# EAGLE design miditendo_rev1 (EAGLE 6.0)
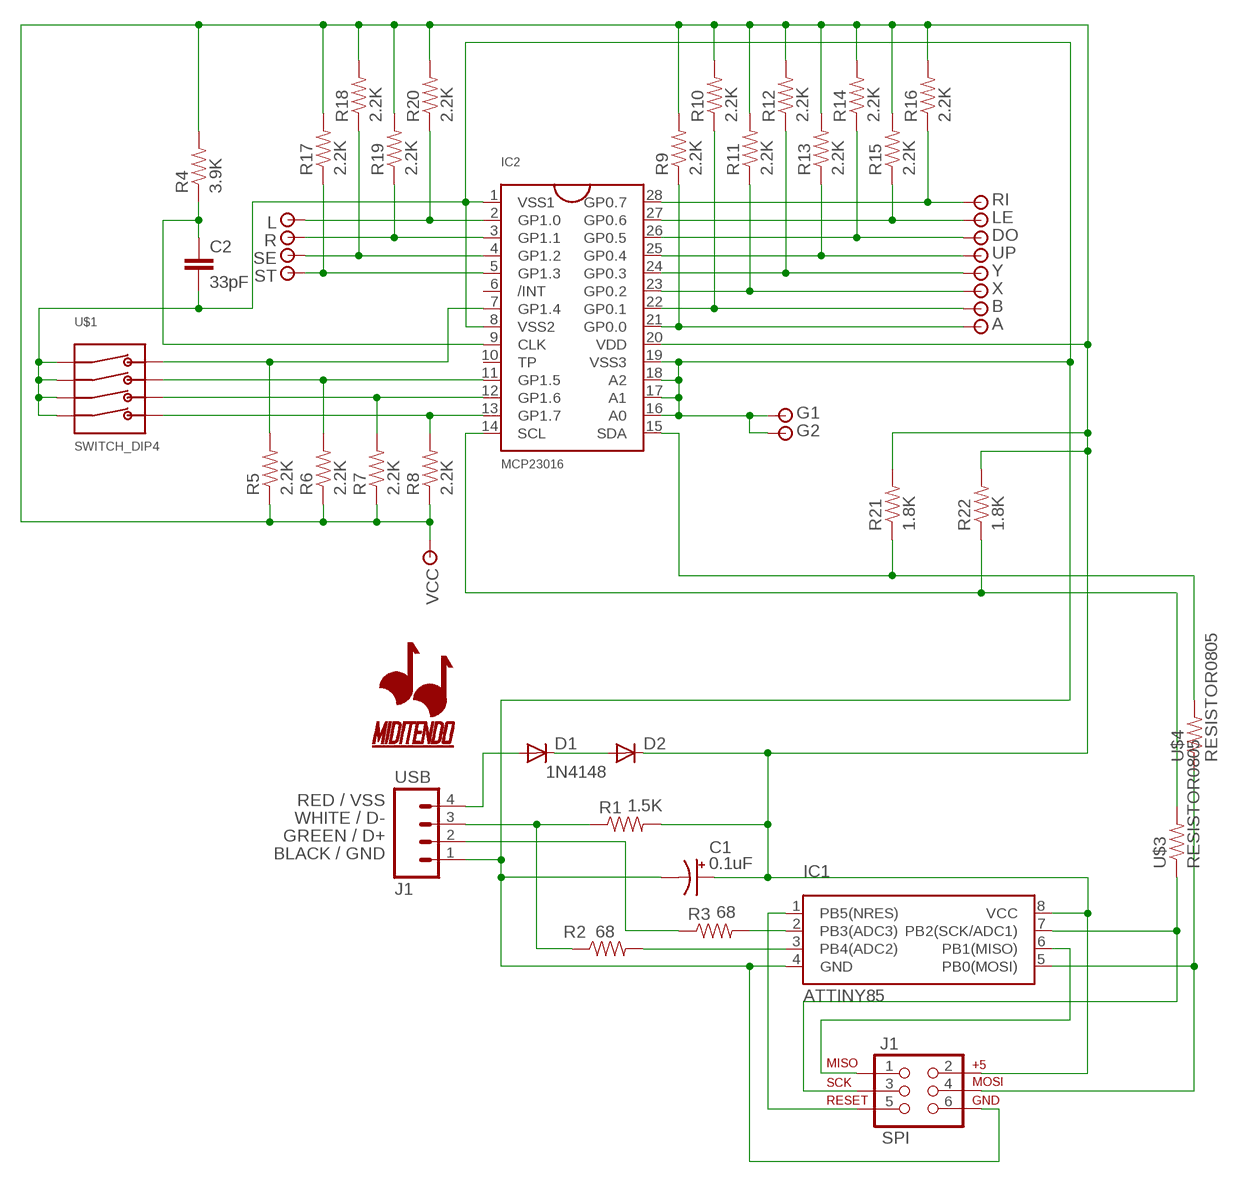
[diagram p0: schematic, sheet 1]

## Parts
A  WIRE_JOINT  [THSOLDERPOINT]
B  WIRE_JOINT  [THSOLDERPOINT]
C1  0.1uF  POLARIZEDCAPACITORTH_2.54  [POLCAP_2.54]
C2  33pF  CAPACITOR0805  [0805]
D1  LL4148SOD-80C  [SOD-80C]
D2  1N4148  LL4148SOD-80C  [SOD-80C]
DO  WIRE_JOINT  [THSOLDERPOINT]
G1  WIRE_JOINT  [THSOLDERPOINT]
G2  WIRE_JOINT  [THSOLDERPOINT]
IC1  ATTINY85  ATTINY85SOIC  [SOIC8-EIAJ]
IC2  MCP23016  MCP23016SOIC28  [SOIC28]
J1  SPI  AVR_SPI_PRG_6NS  [2X3-NS]
L  WIRE_JOINT  [THSOLDERPOINT]
LE  WIRE_JOINT  [THSOLDERPOINT]
R  WIRE_JOINT  [THSOLDERPOINT]
R1  1.5K  RESISTOR0805  [0805]
R2  68  RESISTOR0805  [0805]
R3  68  RESISTOR0805  [0805]
R4  3.9K  RESISTOR0805  [0805]
R5  2.2K  RESISTOR0805  [0805]
R6  2.2K  RESISTOR0805  [0805]
R7  2.2K  RESISTOR0805  [0805]
R8  2.2K  RESISTOR0805  [0805]
R9  2.2K  RESISTOR0805  [0805]
R10  2.2K  RESISTOR0805  [0805]
R11  2.2K  RESISTOR0805  [0805]
R12  2.2K  RESISTOR0805  [0805]
R13  2.2K  RESISTOR0805  [0805]
R14  2.2K  RESISTOR0805  [0805]
R15  2.2K  RESISTOR0805  [0805]
R16  2.2K  RESISTOR0805  [0805]
R17  2.2K  RESISTOR0805  [0805]
R18  2.2K  RESISTOR0805  [0805]
R19  2.2K  RESISTOR0805  [0805]
R20  2.2K  RESISTOR0805  [0805]
R21  1.8K  RESISTOR0805  [0805]
R22  1.8K  RESISTOR0805  [0805]
RI  WIRE_JOINT  [THSOLDERPOINT]
SE  WIRE_JOINT  [THSOLDERPOINT]
ST  WIRE_JOINT  [THSOLDERPOINT]
U$1  SWITCH_DIP4  [SWITCH_4DIP]
U$2  MIDITENDO  [MIDITENDO]
U$3  RESISTOR0805  [0805]
U$4  RESISTOR0805  [0805]
UP  WIRE_JOINT  [THSOLDERPOINT]
USB  J1  M04LONGPADS  [1X04_LONGPADS]
VCC  WIRE_JOINT  [THSOLDERPOINT]
X  WIRE_JOINT  [THSOLDERPOINT]
Y  WIRE_JOINT  [THSOLDERPOINT]

## Nets
GND: C1.N(-) C2.2 G1.P$1 G2.P$1 IC1.4(GND) IC2.1(VSS1) IC2.8(VSS2) IC2.16(A0) IC2.17(A1) IC2.18(A2) IC2.19(VSS3) J1.6 U$1.P$1 U$1.P$2 U$1.P$3 U$1.P$4 USB.1
N$1: D1.PA(A) USB.4
N$2: D1.PC(C) D2.PA(A)
N$3: IC2.2(GP1.0) L.P$1 R20.1
N$4: IC2.15(SDA) R21.1 U$4.2
N$5: R3.1 USB.2
N$6: IC2.14(SCL) R22.1 U$3.2
N$7: IC1.2(PB3(ADC3)) R3.2
N$8: IC1.3(PB4(ADC2)) R2.2
N$9: IC2.3(GP1.1) R19.1 R.P$1
N$10: R1.1 R2.1 USB.3
N$11: IC2.4(GP1.2) R18.1 SE.P$1
N$12: IC2.5(GP1.3) R17.1 ST.P$1
N$13: IC2.28(GP0.7) R16.1 RI.P$1
N$14: IC2.27(GP0.6) LE.P$1 R15.1
N$15: DO.P$1 IC2.26(GP0.5) R14.1
N$16: IC2.25(GP0.4) R13.1 UP.P$1
N$17: IC2.24(GP0.3) R12.1 Y.P$1
N$18: IC2.23(GP0.2) R11.1 X.P$1
N$19: B.P$1 IC2.22(GP0.1) R10.1
N$20: A.P$1 IC2.21(GP0.0) R9.1
N$21: C2.1 IC2.9(CLK) R4.1
N$22: IC1.6(PB1(MISO)) J1.1
N$23: IC1.1(PB5(NRES)) J1.5
N$24: IC1.7(PB2(SCK/ADC1)) J1.3 U$3.1
N$25: IC1.5(PB0(MOSI)) J1.4 U$4.1
N$26: IC2.13(GP1.7) R8.2 U$1.P$5
N$27: IC2.12(GP1.6) R7.2 U$1.P$6
N$28: IC2.11(GP1.5) R6.2 U$1.P$7
N$29: IC2.7(GP1.4) R5.2 U$1.P$8
VDD: C1.P(+) D2.PC(C) IC1.8(VCC) IC2.20(VDD) J1.2 R1.2 R4.2 R5.1 R6.1 R7.1 R8.1 R9.2 R10.2 R11.2 R12.2 R13.2 R14.2 R15.2 R16.2 R17.2 R18.2 R19.2 R20.2 R21.2 R22.2 VCC.P$1
Unconnected: IC2.6(/INT) IC2.10(TP)

## Notes on the sheet
- RED / VSS
- WHITE / D-
- GREEN / D+
- BLACK / GND

## Library data of the parts
A B DO G1 G2 L LE R RI SE ST UP VCC X Y = miditendo:WIRE_JOINT
C1 = miditendo:POLARIZEDCAPACITOR: POLARIZED CAPACITORPolarized Capacitor
C2 = miditendo:CAPACITOR
D1 D2 = miditendo:LL4148: 4148 DIODE The xx4148 diode is a fast, standard small signal silicon diode with high conductance used in signal processing. The 1N4148 variant is generally available in a DO-35 glass package and is very useful at high frequencies with a reverse recovery time of no more than 4ns. This permits rectification and detection of radio frequency signals very effectively, as long as their amplitude is above the forward conduction threshold of silicon (around 0.7V) or the diode is biased.
IC1 = miditendo:ATTINY85: ATTINY85 The ATtiny85 is a low-power CMOS 8-bit microcontroller based on the AVR enhanced RISC architecture. By executing powerful instructions in a single clock cycle, the ATtiny85 achieves throughputs approaching 1 MIPS per MHz allowing the system designer to optimize power consumption versus processing speed -8K Bytes of In-System Programmable Program Memory Flash -512 Bytes In-System Programmable EEPROM -512 Bytes Internal SRAM
IC2 = miditendo:MCP23016
J1 = SparkFun:AVR_SPI_PRG_6: AVR ISP 6 Pin This is the reduced ISP connector for AVR programming. Common on Arduino. This footprint will take up less PCB space and can be used with a 10-pin to 6-pin adapter such as SKU: BOB-08508
R1-R22 U$3 U$4 = miditendo:RESISTOR: RESISTOR
U$1 = miditendo:SWITCH_DIP4
U$2 = miditendo:MIDITENDO
USB = SparkFun:M04: Header 4 Standard 4-pin 0.1" header. Use with straight break away headers (SKU : PRT-00116), right angle break away headers (PRT-00553), swiss pins (PRT-00743), machine pins (PRT-00117), and female headers (PRT-00115). Molex polarized connector foot print use with SKU : PRT-08231 with associated crimp pins and housings. 1MM SMD Version SKU: PRT-10208

## Board
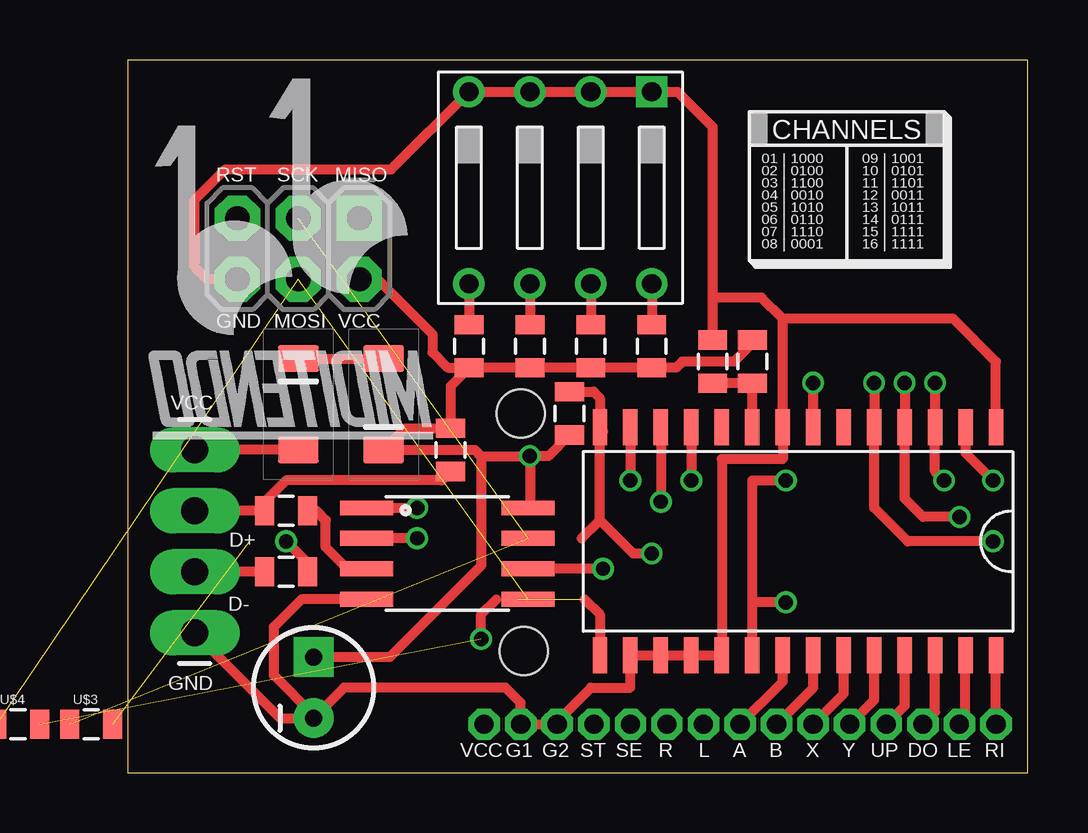
[diagram p1: board, top side]
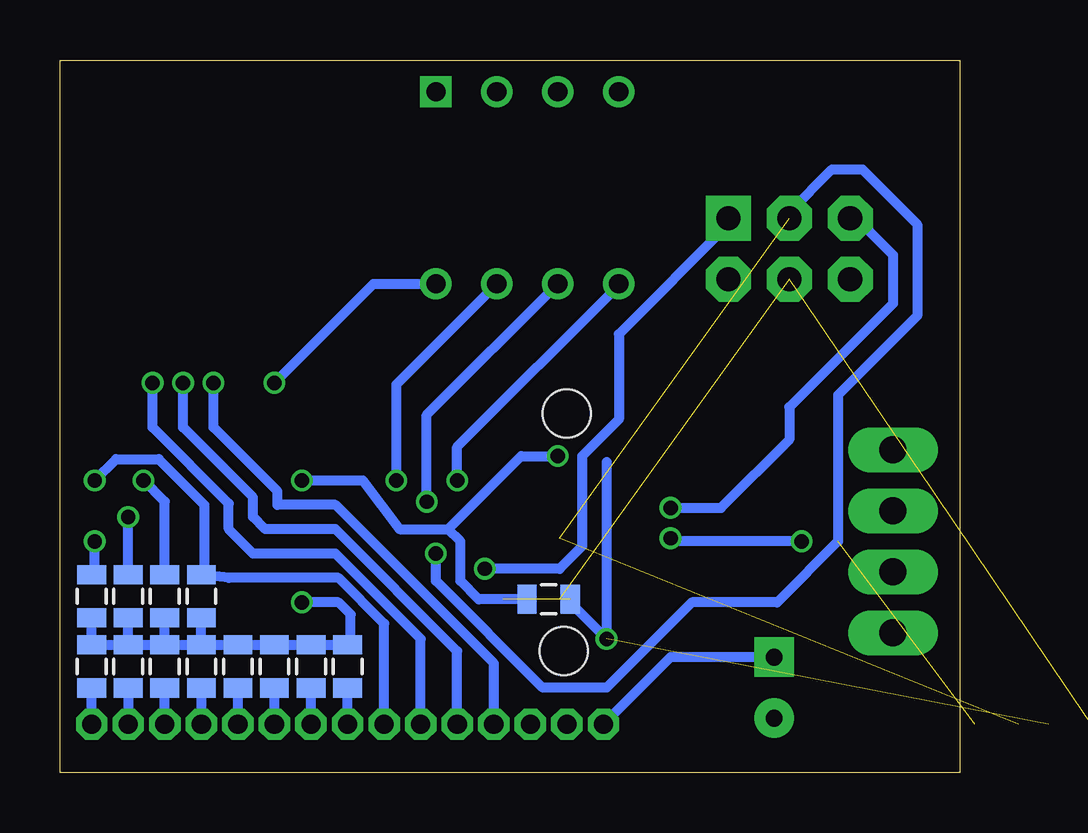
[diagram p2: board, bottom side, seen from below]

Size 37.52 x 29.71 mm. Coordinates in mm from the lower left corner, seen from the top.
Outline: 0,0 37.52,0 37.52,29.71 0,29.71 0,0
Copper layers (1*16): Top 0.035mm / dielectric 1.5mm / Bottom 0.035mm
Design rules: minimum track width 6mil, minimum drill 12mil, track to track 6mil, track to pad 6mil, pad to pad 6mil, via to via 6mil, smd to smd 0mil, copper to edge 10mil, drill to drill 10mil, minimum pad ring 10mil, minimum via ring 6mil, stop-mask expansion 2mil, vias tented up to drill 100mil, thermal gap 10mil
Holes 2 mm at 16.51,5.08 16.38,14.99

### Footprints (pad centres in the part's own frame; a part is rotated, then mirrored left to right if it is on the bottom)
THSOLDERPOINT = drill 0.8 octagon: P$1 0,0
POLCAP_2.54 = drill 0.7 pad 1.651: N -1.27,0 | drill 0.7 pad 1.651 square: P 1.27,0
0805 = smd 0.8 x 1.2: 1 -0.9,0; 2 0.9,0
SOD-80C = smd 1.1 x 1.7: PA -1.9,0; PC 1.9,0
SOIC8-EIAJ = smd 0.61 x 2.21: 1 -1.905,-3.378; 2 -0.635,-3.378; 3 0.635,-3.378; 4 1.905,-3.378; 5 1.905,3.353; 6 0.635,3.353; 7 -0.635,3.353; 8 -1.905,3.353
SOIC28 = smd 0.6 x 1.5: 1 -8.255,-4.75; 2 -6.985,-4.75; 3 -5.715,-4.75; 4 -4.445,-4.75; 5 -3.175,-4.75; 6 -1.905,-4.75; 7 -0.635,-4.75; 8 0.635,-4.75; 9 1.905,-4.75; 10 3.175,-4.75; 11 4.445,-4.75; 12 5.715,-4.75; 13 6.985,-4.75; 14 8.255,-4.75; 15 8.255,4.75; 16 6.985,4.75; 17 5.715,4.75; 18 4.445,4.75; 19 3.175,4.75; 20 1.905,4.75; 21 0.635,4.75; 22 -0.635,4.75; 23 -1.905,4.75; 24 -3.175,4.75; 25 -4.445,4.75; 26 -5.715,4.75; 27 -6.985,4.75; 28 -8.255,4.75
2X3-NS = drill 1.016 pad 1.88 square: 1 -2.54,-1.27 | drill 1.016 pad 1.88 octagon: 2 -2.54,1.27; 3 0,-1.27; 4 0,1.27; 5 2.54,-1.27; 6 2.54,1.27
SWITCH_4DIP = drill 0.8 square: P$1 -3.81,-4 | drill 0.8: P$2 -1.27,-4; P$3 1.27,-4; P$4 3.81,-4; P$5 3.81,4; P$6 1.27,4; P$7 -1.27,4; P$8 -3.81,4
1X04_LONGPADS = drill 1.118 pad 1.88 long: 1 0,0; 2 2.54,0; 3 5.08,0; 4 7.62,0

### Placement (x,y rotation side)
A  25.53,2.03 0 top
B  27.05,2.03 0 top
C1  7.75,3.56 90 top
C2  24.38,17.14 90 top
D1  7.11,15.37 90 top
D2  10.67,15.37 270 top
DO  33.15,2.03 180 top
G1  16.38,2.03 0 top
G2  17.91,2.03 0 top
IC1  13.34,9.14 270 top
IC2  27.94,9.65 180 top
J1  7.11,21.84 180 top
L  24,2.03 0 top
LE  34.67,2.03 0 top
R  22.48,2.03 0 top
R1  13.46,13.46 90 top
R2  6.6,10.92 0 top
R3  6.6,8.38 0 top
R4  26.04,17.14 90 top
R5  21.84,17.78 90 top
R6  19.3,17.78 90 top
R7  16.76,17.78 90 top
R8  14.22,17.78 90 top
R9  25.53,4.45 90 bottom
R10  27.05,4.45 90 bottom
R11  28.57,4.45 90 bottom
R12  30.1,4.45 90 bottom
R13  31.62,4.45 90 bottom
R14  33.15,4.45 90 bottom
R15  34.67,4.45 90 bottom
R16  36.2,4.45 90 bottom
R17  36.2,7.37 270 bottom
R18  34.67,7.37 270 bottom
R19  33.15,7.37 270 bottom
R20  31.62,7.37 270 bottom
R21  17.14,7.24 180 bottom
R22  18.41,14.99 270 top
RI  36.2,2.03 180 top
SE  20.95,2.03 0 top
ST  19.43,2.03 0 top
U$1  18.03,24.38 180 top
U$2  7.11,21.34 0 bottom
U$3  -1.52,2.03 0 top
U$4  -4.57,2.03 0 top  (outside the outline)
UP  31.62,2.03 0 top
USB  2.79,5.84 90 top
VCC  14.86,2.03 0 top
X  28.57,2.03 0 top
Y  30.1,2.03 0 top

### Tracks (layer width: path | path; a pad name or v marks a point on that pad's centre or on a via)
GND
  Top 0.406: USB.1 6.35,2.29 C1.N | C1.N 7.75,2.41 6.1,4.06 6.1,6.1 7.24,7.24 IC1.4 | C1.N 9.02,3.56 15.75,3.56 16.38,2.92 G1.P$1 G2.P$1 17.91,2.16 19.3,3.56 20.95,3.56 IC2.16 IC2.17 IC2.18 IC2.19 24.77,13.08 27.3,13.08 IC2.8 27.3,18.8 | 24.38,19.81 24.38,26.92 22.92,28.38 U$1.P$1 U$1.P$2 U$1.P$3 U$1.P$4 10.99,25.15 4.06,25.15 2.79,23.88 2.79,21.08 3.3,20.57 J1.6 | 24.38,19.81 C2.2 | 27.3,18.8 27.3,18.92 26.42,19.81 24.38,19.81 | IC2.1 36.2,17.14 34.42,18.92 27.43,18.92 27.3,18.8
N$1
  Top 0.406: D1.PA USB.4
N$2
  Top 0.406: D1.PC D2.PA
N$3  (via drill 0.6)
  Top 0.406: IC2.2 34.92,13.34 v36.07,12.19
  Bottom 0.406: L.P$1 24,6.22 25.91,8.13 30.47,8.13 R20.1 31.5,8.39 31.5,11.18 33.4,13.08 35.18,13.08 v36.07,12.19
N$4  (via drill 0.6)  (2 unrouted)
  Top 0.406: 19.05,7.24 19.68,6.6 IC2.15 | v14.73,5.59 14.73,6.6 15.37,7.24
  Bottom 0.406: 14.73,12.95 v14.73,5.59 16.25,7.1 R21.1
N$5
  Top 0.406: R3.1 USB.2
N$6  (via drill 0.6)  (1 unrouted)
  Top 0.406: 18.92,9.78 19.68,10.54 | v21.84,9.14 21.08,9.14 19.68,10.54 | 19.68,10.54 19.68,14.35 | 19.68,14.48 IC2.14 | IC2.14 19.68,14.35 | 19.68,14.35 19.81,14.22 | R22.1 19.42,15.89 19.68,15.62 IC2.14
  Bottom 0.406: 7.11,23.37 5.33,25.15 4.06,25.15 1.78,22.86 1.78,19.05 5.08,15.75 5.08,9.65 7.62,7.11 11.18,7.11 14.73,3.56 17.4,3.56 21.84,8 v21.84,9.14
N$7  (via drill 0.6)
  Top 0.406: R3.2 7.5,8.75 v6.6,9.65 | v12.06,9.78 IC1.2
  Bottom 0.406: v6.6,9.65 11.94,9.65 v12.06,9.78
N$8
  Top 0.406: R2.2 7.87,10.92 8.26,10.54 8.26,9.4 9.14,8.51 IC1.3
N$9  (via drill 0.6)
  Top 0.406: v34.04,12.19 33.66,12.57 IC2.3 v33.66,16.26
  Bottom 0.406: R19.1 33.15,11.3 v34.04,12.19 | R.P$1 22.48,5.59 26.04,9.14 29.46,9.14 30.48,10.16 30.48,11.23 IC2.3 v33.66,16.26
N$10
  Top 0.406: R1.1 13.09,12.19 6.6,12.19 5.7,11.29 R2.1 USB.3
N$11  (via drill 0.6)
  Top 0.406: v34.67,10.67 33.15,10.67 32.38,11.43 IC2.4 v32.38,16.26
  Bottom 0.406: R18.1 v34.67,10.67 | SE.P$1 20.95,5.08 26.04,10.16 28.96,10.16 29.46,10.67 29.46,11.48 IC2.4 v32.38,16.26
N$12  (via drill 0.6)
  Top 0.406: v36.07,9.65 32.51,9.65 31.11,11.05 IC2.5 v31.11,16.26
  Bottom 0.406: 36.07,8.14 36.07,8.13 36.2,8.26 R17.1 36.07,8.14 | 36.07,8.14 v36.07,9.65 | ST.P$1 19.43,4.57 26.04,11.18 28.45,11.18 28.45,11.73 IC2.5 v31.11,16.26
N$13
  Top 0.406: RI.P$1 IC2.28
  Bottom 0.406: RI.P$1 R16.1
N$14
  Top 0.406: LE.P$1 34.92,2.29 IC2.27
  Bottom 0.406: R15.1 LE.P$1
N$15
  Top 0.406: DO.P$1 33.66,2.54 IC2.26
  Bottom 0.406: DO.P$1 R14.1
N$16
  Top 0.406: UP.P$1 32.38,2.79 IC2.25
  Bottom 0.406: R13.1 UP.P$1
N$17
  Top 0.406: Y.P$1 31.11,3.05 IC2.24
  Bottom 0.406: Y.P$1 R12.1
N$18
  Top 0.406: X.P$1 29.84,3.3 IC2.23
  Bottom 0.406: X.P$1 R11.1
N$19
  Top 0.406: B.P$1 28.57,3.56 IC2.22
  Bottom 0.406: B.P$1 R10.1
N$20
  Top 0.406: A.P$1 27.3,3.81 IC2.21
  Bottom 0.406: A.P$1 R9.1
N$21
  Top 0.406: IC2.9 R4.1 C2.1
N$22  (via drill 0.6)
  Top 0.406: v19.81,8.51 IC1.6
  Bottom 0.406: J1.1 9.65,22.86 14.22,18.29 14.22,14.73 15.75,13.21 15.75,9.45 IC1.6 v19.81,8.51
N$23  (via drill 0.6)
  Top 0.406: IC1.1 v12.06,11.05
  Bottom 0.406: J1.5 4.32,23.11 2.79,21.59 2.79,19.56 7.11,15.24 7.11,13.89 IC1.1 v12.06,11.05
N$24  (2 unrouted)
N$25  (2 unrouted)
N$26  (via drill 0.6)
  Top 0.406: U$1.P$5 R8.2 | IC2.13 v20.95,12.19
  Bottom 0.406: v20.95,12.19 20.95,13.59 14.22,20.32 U$1.P$5
N$27  (via drill 0.6)
  Top 0.406: U$1.P$6 R7.2 | IC2.12 v22.23,11.3
  Bottom 0.406: v22.23,11.3 22.23,14.92 U$1.P$6
N$28  (via drill 0.6)
  Top 0.406: U$1.P$7 R6.2 | IC2.11 v23.5,12.19
  Bottom 0.406: v23.5,12.19 23.5,16.19 U$1.P$7
N$29  (via drill 0.6)
  Top 0.406: U$1.P$8 R5.2 | IC2.7 v28.57,16.26
  Bottom 0.406: v28.57,16.26 24.45,20.38 U$1.P$8
VDD  (via drill 0.6)
  Top 0.406: 14.73,13.21 14.48,13.46 D2.PC 11.56,14.36 R1.2 13.46,16.12 R8.1 | 14.73,13.21 14.73,8.64 10.92,4.83 C1.P | R4.2 26.04,17.91 25.27,17.14 23.11,17.14 22.86,16.89 21.86,16.89 R5.1 R6.1 R7.1 R8.1 | IC2.20 26.04,7.11 | 26.04,7.11 26.04,12.19 v27.43,12.19 | v16.76,13.21 16.76,11.12 IC1.8 | 14.73,13.21 v16.76,13.21 | v27.43,7.11 26.04,7.11 | J1.2 10.41,20.57 12.7,18.29 12.7,17.53 13.34,16.89 R8.1 | R22.2 17.54,13.21 v16.76,13.21
  Bottom 0.406: C1.P 12.06,4.83 VCC.P$1 | R15.2 R16.2 R17.2 | R15.2 R14.2 | R14.2 R13.2 | R13.2 R12.2 R11.2 R10.2 R9.2 25.4,5.34 25.4,6.6 25.91,7.11 v27.43,7.11 | 34.54,6.6 R18.2 R15.2 | R14.2 R19.2 | R13.2 R20.2 | v27.43,12.19 24.89,12.19 23.37,10.16 21.34,10.16 | 21.34,10.16 18.29,13.21 v16.76,13.21 | R21.2 20.07,7.24 20.83,8 20.83,9.65 21.34,10.16

### Text on the board
tNames: CHANNELS | RST | SCK | MISO | 01 | 1000 | 02 | 0100 | 09 | 1001 | 10 | 0101 | 03 | 1100 | 04 | 0010 | 11 | 1101 | 12 | 0011 | 05 | 1010 | 06 | 0110 | 13 | 1011 | 14 | 0111 | 07 | 1110 | 08 | 0001 | 15 | 1111 | 16 | 1111 | GND | MOSI | VCC | VCC | D+ | D- | GND